# EasyEDA schematic 1-Schematic_Antenna analyzer (SMD).json
TITLE: Antenna analyzer (SMD): Main module; REV: 1.2.0; Date: 2019-02-12; Sheet: 1/1; Drawn By: IgrikXD; Company: Open Hardware
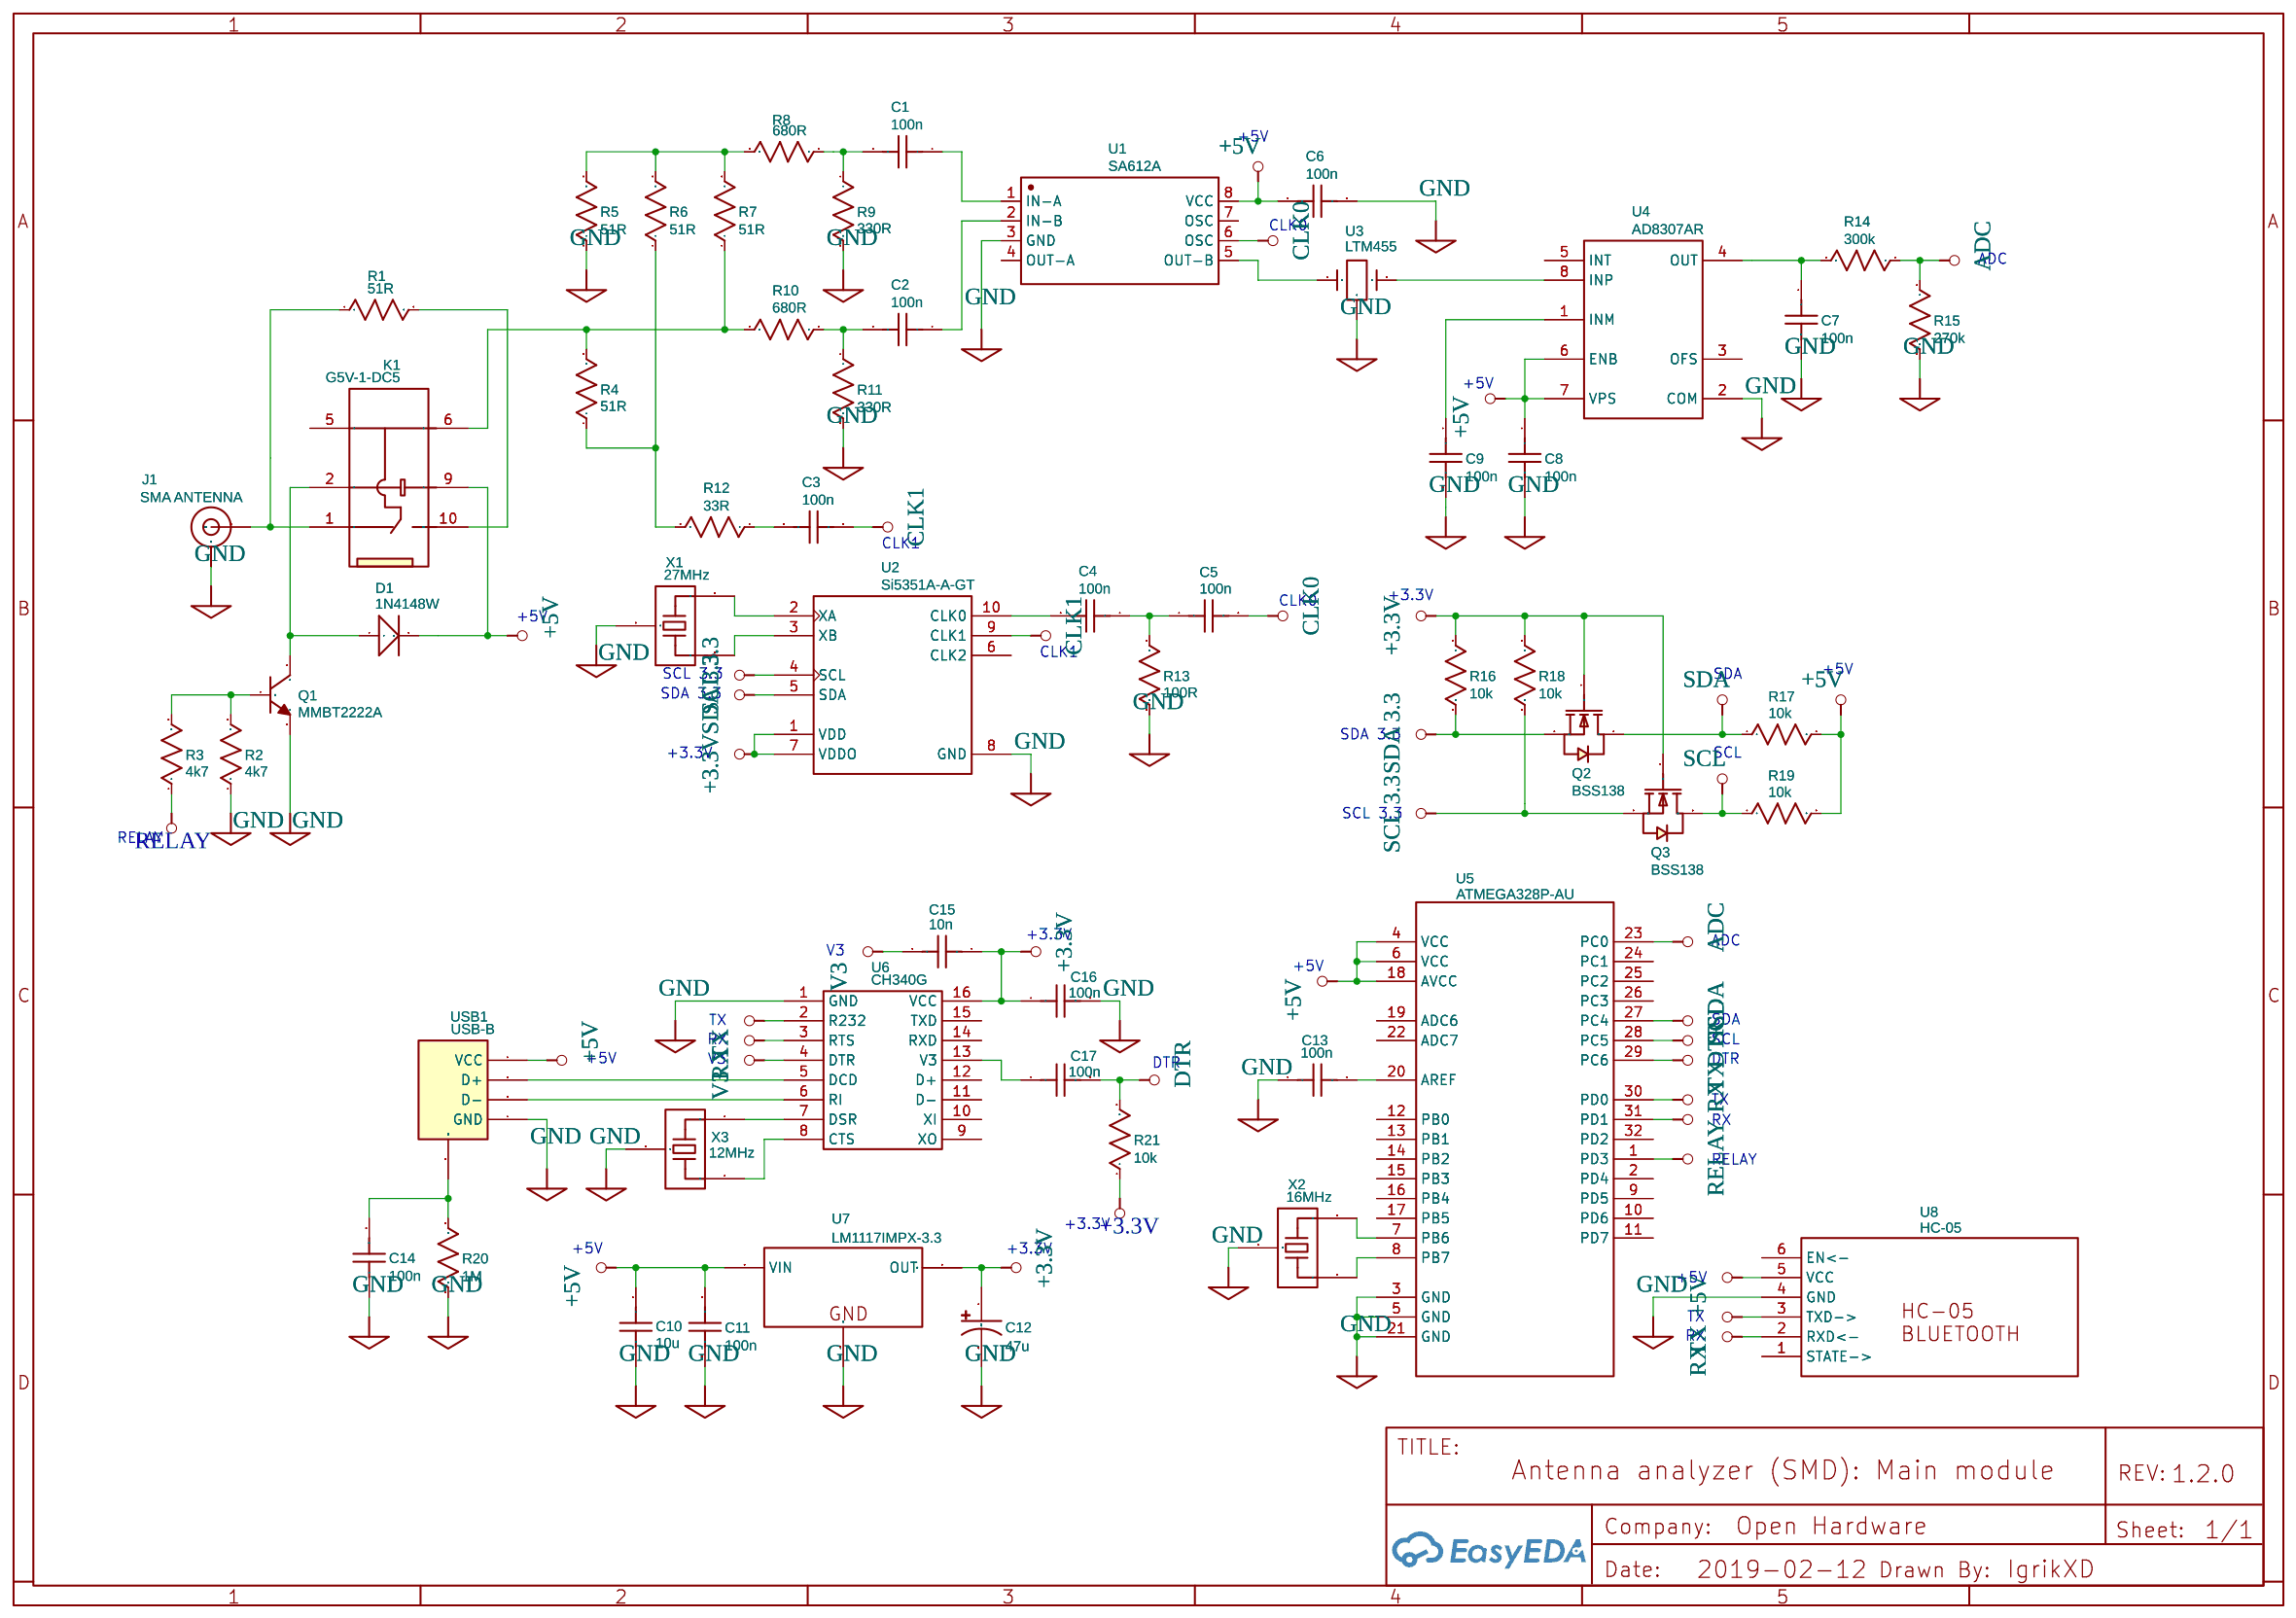
[diagram p0: schematic sheet]

## Parts
C1  100n  [0805]
C2  100n  [0805]
C3  100n  [0805]
C4  100n  [0805]
C5  100n  [0805]
C6  100n  [0805]
C7  100n  [0805]
C8  100n  [0805]
C9  100n  [0805]
C10  10u  [0805]
C11  100n  [0805]
C12  47u  [CASE-B_3528]
C13  100n  [0805]
C14  100n  [0805]
C15  10n  [0805]
C16  100n  [0805]
C17  100n  [0805]
D1  1N4148W  [SOD-123]
J1  SMA ANTENNA  [SMA-EDGE]
K1  G5V-1-DC5  [RELAY-OMRON_G5V1]
Q1  MMBT2222A  [SOT-23(SOT-23-3)]
Q2  BSS138  [SOT-23-3]
Q3  BSS138  [SOT-23-3]
R1  51R  [0805]
R2  4k7  [0805]
R3  4k7  [0805]
R4  51R  [0805]
R5  51R  [0805]
R6  51R  [0805]
R7  51R  [0805]
R8  680R  [0805]
R9  330R  [0805]
R10  680R  [0805]
R11  330R  [0805]
R12  33R  [0805]
R13  100R  [0805]
R14  300k  [0805]
R15  270k  [0805]
R16  10k  [0805]
R17  10k  [0805]
R18  10k  [0805]
R19  10k  [0805]
R20  1M  [0805]
R21  10k  [0805]
U1  SA612A  [SOP-8]
U2  Si5351A-A-GT  [MSOP10]
U3  LTM455  [CFW455IT]
U4  AD8307AR  [SOP-8]
U5  ATMEGA328P-AU  [TQFP-32_7X7X08P]
U6  CH340G  [SOIC-16_150MIL]
U7  LM1117IMPX-3.3  [SOT223]
U8  HC-05  [HC-05_BLUETOOTH]
USB1  USB-B  [USB TYPE B]
X1  27MHz  [CRYSTAL_SMD_3225-4PIN_3.2X2.5MM]
X2  16MHz  [3213]
X3  12MHz  [3213]

## Library data of the parts
C1-C8 C13 C16 C17 = Cap_0805_US: Manufacturer Part: CC0805JRX7R9BB104; Supplier: LCSC; Supplier Part: C111492; Manufacturer: YAGEO
C9 = Cap_0805_US: Manufacturer Part: CC0805JRX7R9BB104; Supplier: LCSC; Manufacturer: YAGEO; Supplier Part: C111492
C10 = Capacitor: Manufacturer Part: CL21A106KAYNNNE; Supplier: LCSC; Manufacturer: Samsung Electro-Mechanics; Supplier Part: C15850
C11 C14 = Capacitor: Manufacturer Part: CC0805JRX7R9BB104; Supplier: LCSC; Manufacturer: YAGEO; Supplier Part: C111492
C12 = Cap_Electrolytic(TH)_D3.0XF1.5_US: Manufacturer Part: TAJB476K010RNJ; Supplier: LCSC; Supplier Part: C22036; Manufacturer: AVX
C15 = Cap_0805_US: Manufacturer Part: 0805B103J500NT; Supplier: LCSC; Supplier Part: C24666; Manufacturer: Guangdong Fenghua Advanced Tech
D1 = -: Supplier: LCSC; Supplier Part: C129216; Manufacturer: Tak Cheong
J1 = -: Contributor: IgrikXD; Manufacturer Part: ANKX01.0093; Supplier: LCSC; Supplier Part: C129604; Manufacturer: RFsister
K1 = -: Supplier: LCSC; Supplier Part: C152705; Manufacturer: Omron Electronics; Contributor: LCSC
Q1 = -: Supplier: LCSC; Manufacturer: SEMTECH; Supplier Part: C83939
Q2 Q3 = -: Supplier: LCSC; Manufacturer: ON Semicon; Supplier Part: C52895
R1 R4-R7 = Res_0805(1/8W)_US: Manufacturer Part: AR05BTCW0510; Supplier: LCSC; Supplier Part: C318143; Manufacturer: Viking Tech
R2 R3 = Res_0805(1/8W)_US: Manufacturer Part: MCR10EZPD4701; Supplier: LCSC; Supplier Part: C308367; Manufacturer: ROHM Semicon
R8 R10 = Res_0805(1/8W)_US: Manufacturer Part: AR05BTCW6800; Supplier: LCSC; Supplier Part: C318149; Manufacturer: Viking Tech
R9 R11 = Res_0805(1/8W)_US: Manufacturer Part: 5-1614884-2; Supplier: LCSC; Supplier Part: C306269; Manufacturer: TE Connectivity
R12 = Res_0805(1/8W)_US: Manufacturer Part: 0805W8F330JT5E; Supplier: LCSC; Supplier Part: C17634; Manufacturer: Uniroyal Elec
R13 = Res_0805(1/8W)_US: Manufacturer Part: RG2012P-101-B-T5; Supplier: LCSC; Supplier Part: C95679; Manufacturer: SUSUMU
R14 = Res_0805(1/8W)_US: Manufacturer Part: WR08X3003FTL; Supplier: LCSC; Supplier Part: C168438; Manufacturer: Walsin Tech Corp
R15 = Res_0805(1/8W)_US: Manufacturer Part: 0805W8F2703T5E; Supplier: LCSC; Supplier Part: C17589; Manufacturer: Uniroyal Elec
R16-R19 = Res_0805(1/8W)_US: Manufacturer Part: 0805WAD1002T5E; Supplier: LCSC; Supplier Part: C169071; Manufacturer: Uniroyal Elec
R20 = Resistor: Manufacturer Part: RC0805FR-071ML; Supplier: LCSC; Manufacturer: YAGEO; Supplier Part: C107700
R21 = Resistor: Manufacturer Part: 0805WAD1002T5E; Supplier: LCSC; Manufacturer: Uniroyal Elec; Supplier Part: C169071
U3 = -: Contributor: IgrikXD
U5 = -: Supplier: LCSC; Manufacturer: MICROCHIP; Supplier Part: C14877
U6 = -: Supplier: LCSC; Manufacturer: Jiangsu Qin Heng; Supplier Part: C14267; Contributor: IgrikXD
U7 = -: Contributor: IgrikXD; Manufacturer Part: LM1117IMPX-3.3/NOPB; Supplier: LCSC; Supplier Part: C23984; Manufacturer: Texas Instruments
U8 = -: Contributor: IgrikXD; sourceId: Fx3lfxP60
USB1 = -: Supplier Part: C46393; Supplier: LCSC; Manufacturer: LCSC; Manufacturer Part: USB BFemale90 White plastic; Contributor: IgrikXD
X1 = CSTCE16M0V53-R0: Supplier: LCSC; Manufacturer: Harmony Elec; Manufacturer Part: X3S027000BA1H-U; Supplier Part: C136079; Contributor: IgrikXD
X2 = CSTCE16M0V53-R0: Supplier: LCSC; Manufacturer: MuRata; Supplier Part: C32180; Contributor: IgrikXD
X3 = CSTCE16M0V53-R0: Supplier: LCSC; Manufacturer: MuRata; Manufacturer Part: CSTCE12M0G52-R0; Supplier Part: C91580; Contributor: IgrikXD

## Nets
+3.3V: C12.1 C15.1 C16.1 Q2.1(G) Q3.1(G) R16.1 R18.1 R21.1 U2.1(VDD) U2.7(VDDO) U6.16(VCC) U7.2(OUT) U7.4(OUT)
+5V: C6.1 C8.1 C10.1 C11.2 D1.2(C) K1.9 R17.2 R19.2 U1.8(VCC) U4.6(ENB) U4.7(VPS) U5.4(VCC) U5.6(VCC) U5.18(AVCC) U7.3(VIN) U8.5(VCC) USB1.1(VCC)
GND: C6.2 C7.2 C8.2 C9.2 C10.2 C11.1 C12.2 C13.1 C14.1 C16.2 J1.GND@0(GND) J1.GND@1(GND) J1.GND@2(GND) J1.GND@3(GND) Q1.2(E) R2.1 R5.1 R9.2 R11.2 R13.2 R15.2 R20.1 U1.3(GND) U2.8(GND) U3.3 U4.2(COM) U5.3(GND) U5.5(GND) U5.21(GND) U6.1(GND) U7.1(ADJ) U8.4(GND) USB1.4(GND) X1.2 X2.2 X3.2
V3: C15.2 U6.4(DTR)
ADC: R14.1 R15.1 U5.23(PC0)
CLK0: C5.2 U1.6(OSC)
CLK1: C3.1 U2.9(CLK1)
DTR: C17.2 R21.2 U5.29(PC6)
RELAY: R3.1 U5.1(PD3)
RX: U5.31(PD1) U6.3(RTS) U8.2(RXD<-)
SCL: Q3.3(D) R19.1 U5.28(PC5)
SCL 3.3: Q3.2(S) R18.2 U2.4(SCL)
SDA: Q2.3(D) R17.1 U5.27(PC4)
SDA 3.3: Q2.2(S) R16.2 U2.5(SDA)
TX: U5.30(PD0) U6.2(R232) U8.3(TXD->)
C4_1: C4.1 C5.1 R13.1
Net-(D1-1): D1.1(A) K1.2 Q1.3(C)
Net-(J1-SIG): J1.SIG(SIGNAL) K1.1 R1.1
Net-(K1-6): K1.6 R4.2 R7.1 R10.2
Net-(K1-10): K1.10 R1.2
Net-(U6-6): U6.6(RI) USB1.2(D-)
R2_2: Q1.1(B) R2.2 R3.2
R4_1: R4.1 R6.1 R12.2
R5_2: R5.2 R6.2 R7.2 R8.2
R8_1: C1.2 R8.1 R9.1
R10_1: C2.2 R10.1 R11.1
R12_1: C3.2 R12.1
U1_1: C1.1 U1.1(IN-A)
U1_2: C2.1 U1.2(IN-B)
U1_5: U1.5(OUT-B) U3.1
U2_2: U2.2(XA) X1.3
U2_3: U2.3(XB) X1.1
U2_10: C4.2 U2.10(CLK0)
U4_1: C9.1 U4.1(INM)
U4_4: C7.1 R14.2 U4.4(OUT)
U4_8: U3.2 U4.8(INP)
U5_7: U5.7(PB6) X2.3
U5_8: U5.8(PB7) X2.1
U5_20: C13.2 U5.20(AREF)
U6_5: U6.5(DCD) USB1.3(D+)
U6_7: U6.7(DSR) X3.3
U6_8: U6.8(CTS) X3.1
U6_13: C17.1 U6.13(V3)
USB1_5: C14.2 R20.2 USB1.5(CASE)

Not connected (* = marked no-connect by the designer): K1 5; U1 4(OUT-A) 7(OSC); U2 6(CLK2); U4 3(OFS) 5(INT); U5 2(PD4) 9(PD5) 10(PD6) 11(PD7) 12(PB0) 13(PB1) 14(PB2) 15(PB3) 16(PB4) 17(PB5) 19(ADC6) 22(ADC7) 24(PC1) 25(PC2) 26(PC3) 32(PD2); U6 9(XO) 10(XI) 11(D-) 12(D+) 14(RXD) 15(TXD); U8 1(STATE->) 6(EN<-)

## Notes on the sheet
- +5V
- CLK0
- ADC
- +5V
- CLK1
- CLK0
- +3.3V
- +5V
- CLK1
- SCL 3.3
- SDA
- +5V
- SDA 3.3
- SDA 3.3
- +3.3V
- SCL
- SCL 3.3
- RELAY
- +3.3V
- V3
- ADC
- +5V
- TX
- SDA
- RX
- SCL
- +5V
- V3
- DTR
- DTR
- TX
- RX
- RELAY
- +3.3V
- +5V
- +3.3V
- +5V
- RX
- TX
